# Altium schematic sheet Accelerometer.SchDoc
size A3; SheetNumber: 10; SheetTotal: 12
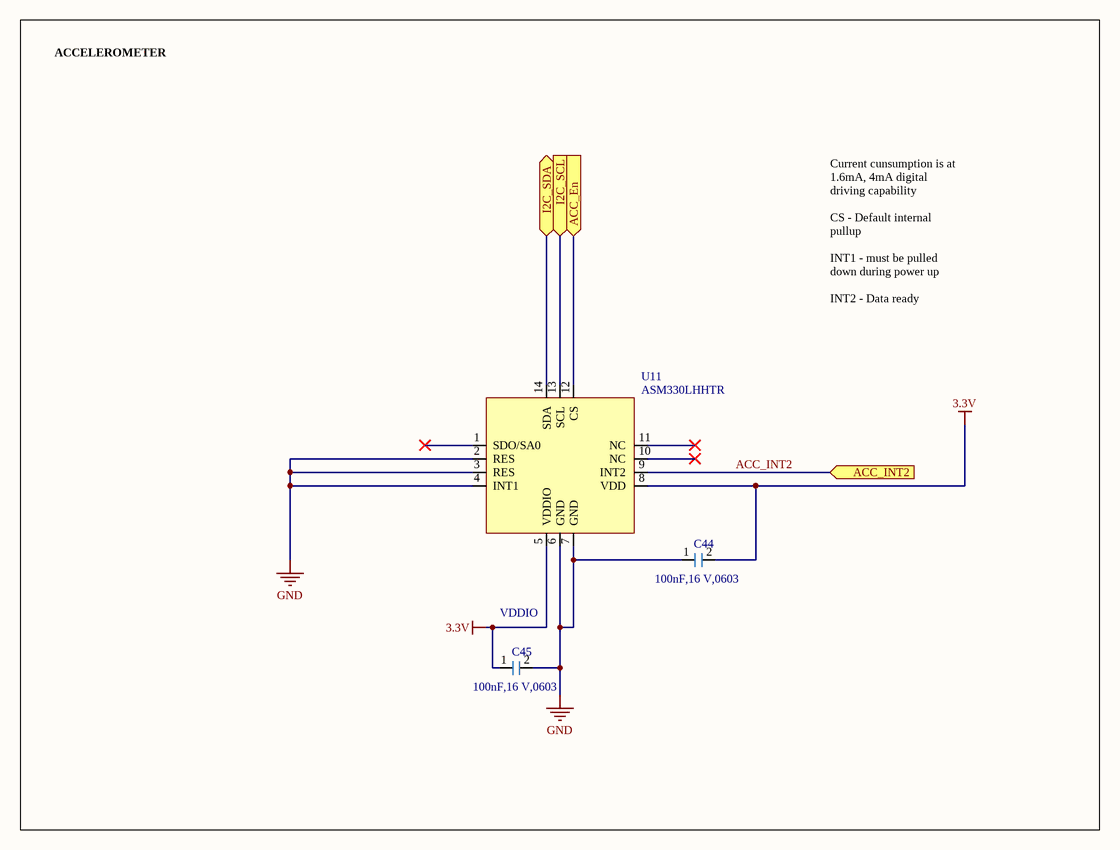
[diagram p0: Accelerometer.SchDoc]

## Parts
C44  Value Display: 100nF,16 V,0603  [CAPC1608X05N 0603]  (hidden comment: CC0603KRX7R7BB104)
C45  Value Display: 100nF,16 V,0603  [CAPC1608X05N 0603]  (hidden comment: CC0603KRX7R7BB104)
U11  ASM330LHHTR  [QFN50P300X250X86-14N_ASM330LHHTR]

## Ports
ACC_En (in), ACC_INT2 (in), I2C_SCL (in), I2C_SDA (bidir)

## Nets
3.3V: C44.2 C45.1 U11.5(VDDIO) U11.8(VDD)
GND: C44.1 C45.2 U11.2(RES) U11.3(RES) U11.4(INT1) U11.6(GND) U11.7(GND)
ACC_En: U11.12(CS) ; port ACC_En
ACC_INT2: U11.9(INT2) ; port ACC_INT2
I2C_SCL: U11.13(SCL) ; port I2C_SCL
I2C_SDA: U11.14(SDA) ; port I2C_SDA

Not connected (* = marked no-connect by the designer): U11 1(SDO/SA0)* 10(NC)* 11(NC)*

## Notes on the sheet
- ACCELEROMETER
- Current cunsumption is at 1.6mA, 4mA digital driving capability
  CS - Default internal pullup
  INT1 - must be pulled down during power up
  INT2 - Data ready
- VDDIO

## Library data of the parts
C44 C45 = Cap_CC0603KRX7R7BB104: Multilayer Ceramic Capacitor, 100 nF, 16V, ±10%,  X7R 0603 [1608 Metric]; Manufacturer: Yageo; Value: 100nF; Max Temp: 125 degC; Min Temp: -55 degC; Polarized: No; AEC-Q: NA; Manufacturer Part Number: CC0603KRX7R7BB104; Category: Capacitor; ComponentLink1Description: Datasheet; Mount Type: Surface Mount; Package: 0603; RoHS: Yes; Supplier 1: Digikey; Supplier 1 Part Number: 311-1088-1-ND; Supplier 1 pricing per Unit: 8.34 INR; Supplier: Mouser; Supplier Part Number: 603-CC603KRX7R7BB104; Supplier pricing per Unit: 8.34 INR; Technology: Ceramic; Temp Coefficient: X7R; Tolerance: 10%; Value 1: CC0603KRX7R7BB104; Voltage: 16V; ComponentLink1URL: https://www.yageo.com/upload/media/product/productsearch/datasheet/mlcc/UPY-GPHC_X7R_6.3V-to-250V_24.pdf
U11 = IC_ASM330LHHTR: Accelerometer, Gyroscope, Temperature, 6 Axis Sensor I2C, SPI Output; Manufacturer: ST; AEC-Q: 100; Max Temp: 105 degC; Min Temp: -40 degC; Value: 6D IMU; Voltage: 3.3V; Category: Inertial module; ComponentLink1Description: Datasheet; ComponentLink1URL: https://www.st.com/resource/en/datasheet/asm330lhh.pdf; Manufacturer Part Number: ASM330LHHTR; Mount Type: Surface Mount; Package: SMT; RoHS: Yes; Supplier 1: Digikey; Supplier 1 Part Number: 497-19078-1-ND; Supplier 1 pricing per Unit: 850.9 INR; Supplier: Mouser; Supplier Part Number: 511-ASM330LHHTR; Supplier pricing per Unit: 810.11 INR; Value 1: ASM330LHHTR; Value Display: ASM330LHHTR